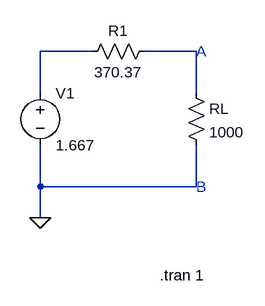
[diagram p0: schematic Thevenin.asc]
Thevenin.asc, the LTspice schematic file:
Version 4
SHEET 1 880 680
WIRE 48 32 -32 32
WIRE 208 32 128 32
WIRE -32 96 -32 32
WIRE 208 96 208 32
WIRE -32 240 -32 176
WIRE 208 240 208 176
WIRE 208 240 -32 240
WIRE -32 288 -32 240
FLAG -32 288 0
SYMBOL voltage -32 80 R0
WINDOW 123 0 0 Left 2
WINDOW 39 0 0 Left 2
SYMATTR InstName V1
SYMATTR Value 1.667
SYMBOL res 32 48 R270
WINDOW 0 32 56 VTop 2
WINDOW 3 0 56 VBottom 2
SYMATTR InstName R1
SYMATTR Value 370.37
SYMBOL res 192 80 R0
SYMATTR InstName RL
SYMATTR Value 1000
TEXT 208 32 Left 2 ;A
TEXT 208 240 Left 2 ;B
TEXT 152 376 Left 2 !.tran 1

The netlist it stands for:
* Thevenin.asc
V1 N001 0 1.667
R1 N001 N002 370.37
RL N002 0 1000
* A
* B
.tran 1
.backanno
.end